# Altium schematic sheet 11-CPU_GPIO.SchDoc
size 431 x 279 mm; Organization: ORGANIZATION; Address1: ADDRESS 1; Address2: ADDRESS 2; Address3: ADDRESS 3; Address4: ADDRESS 4; DocumentNumber: 12; Revision: -; SheetNumber: 11; SheetTotal: 14; ENG_APP_DATE: --/--/--; DSN_APP_DATE: --/--/--; CHK_APP_DATE: --/--/--
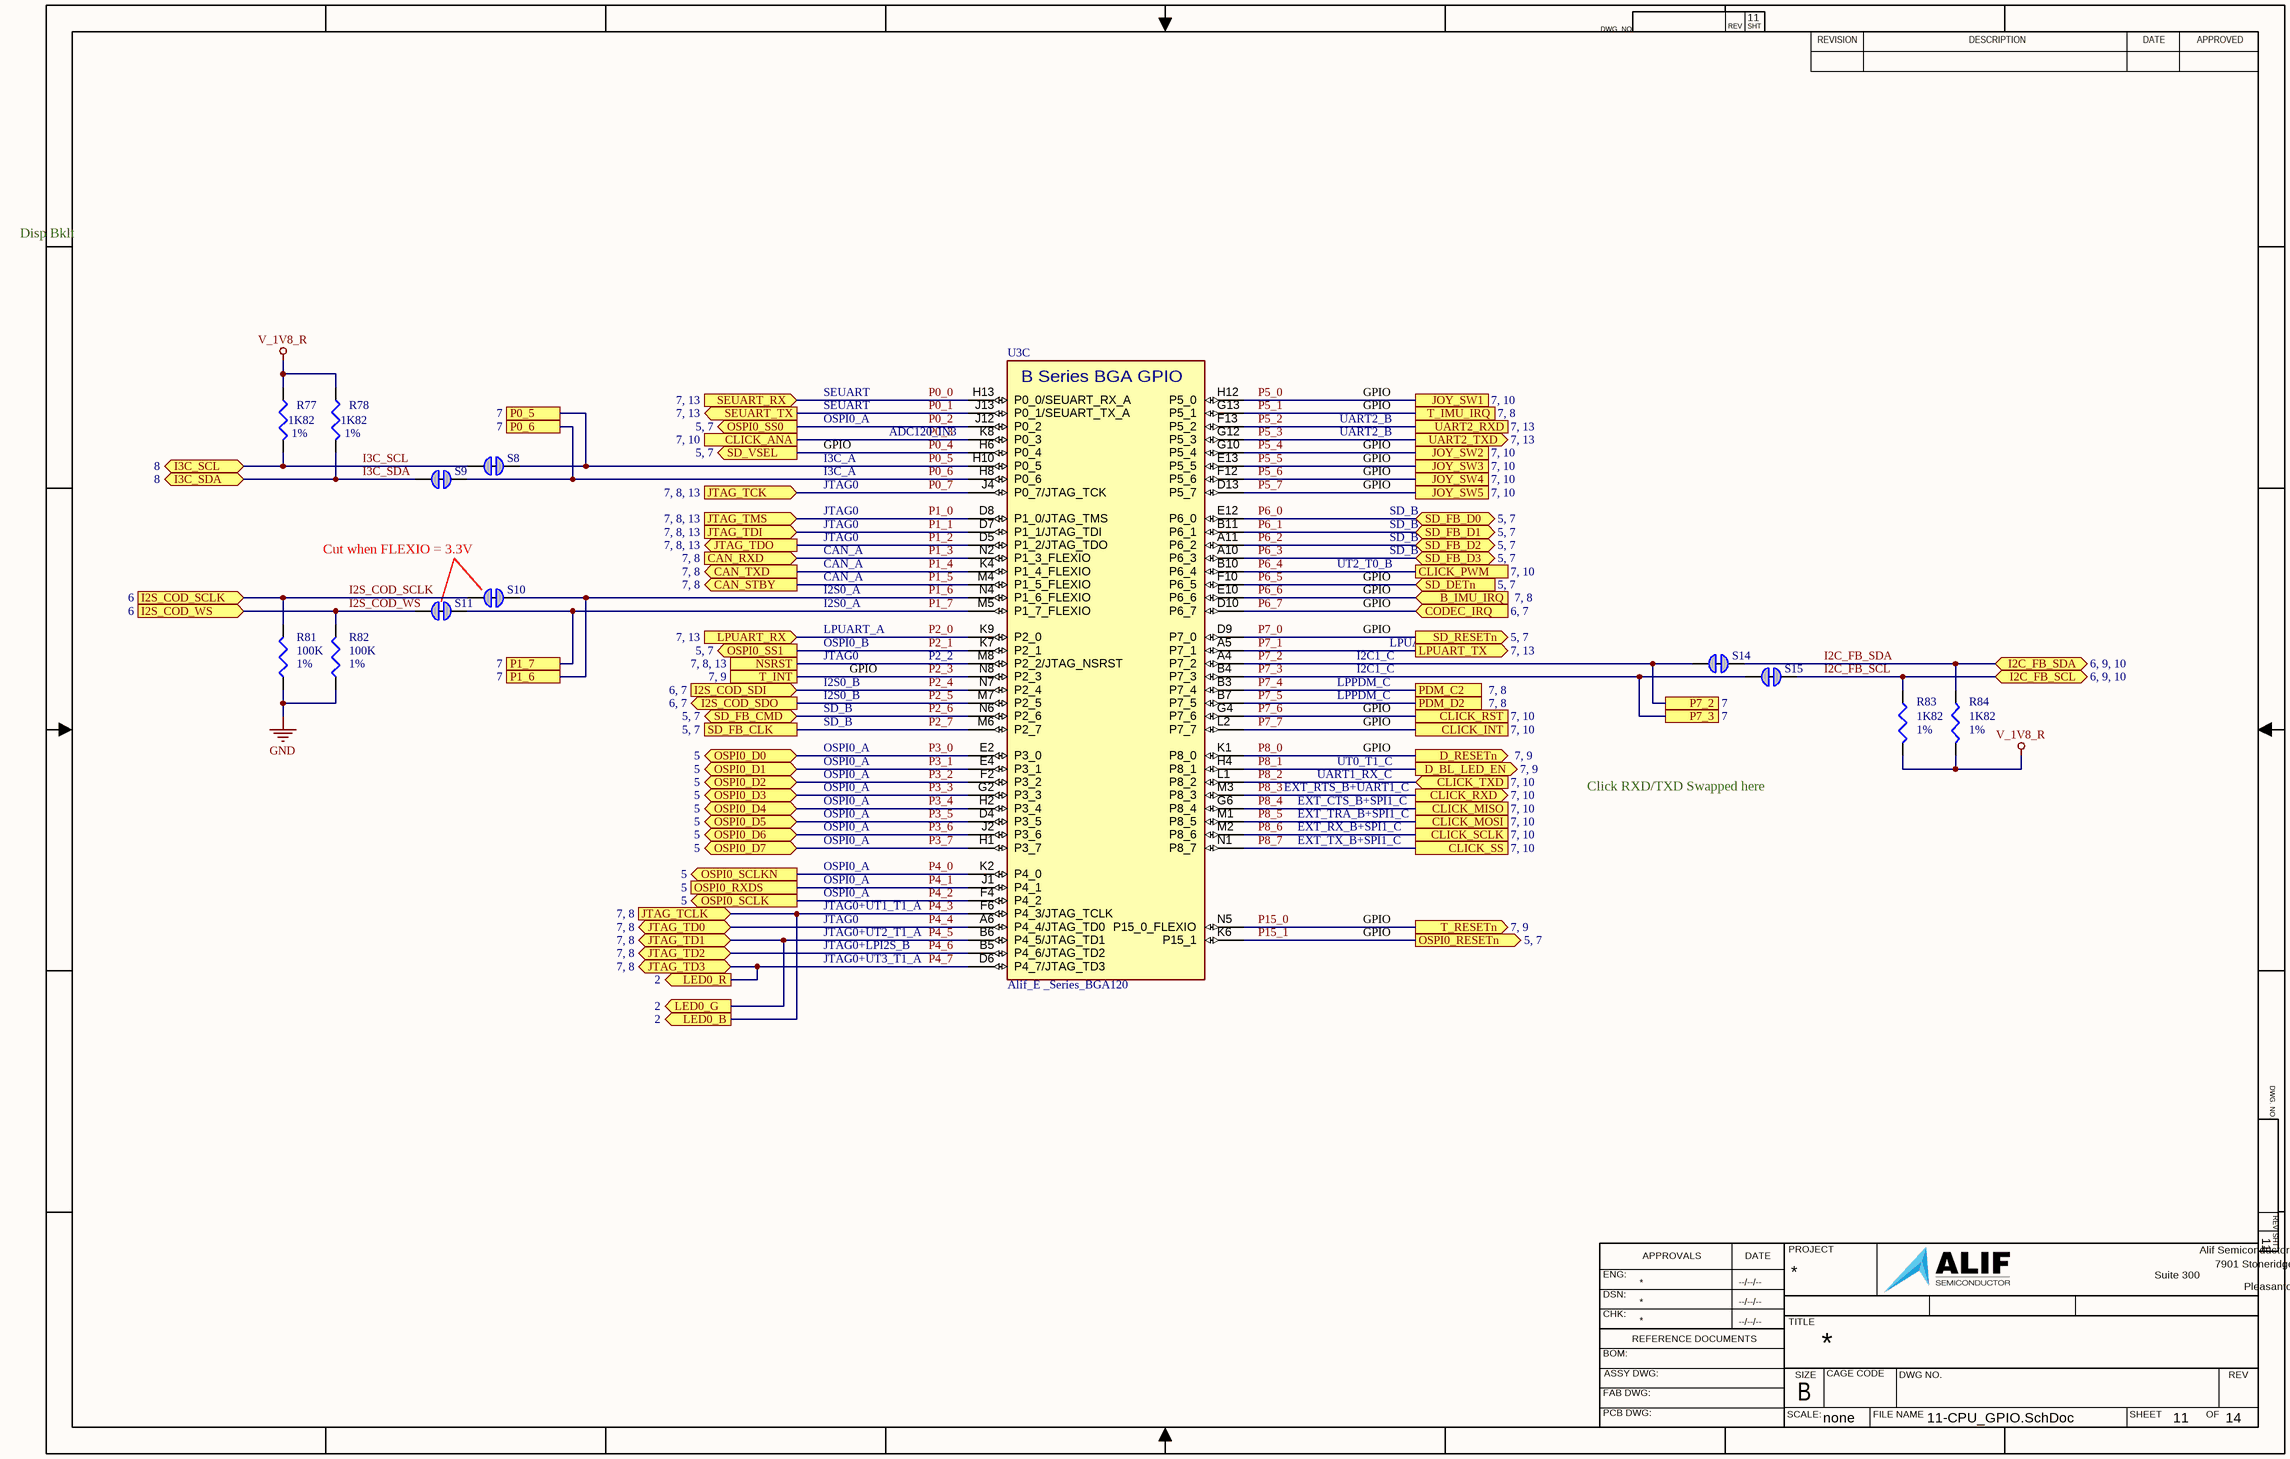
[diagram p0: 11-CPU_GPIO.SchDoc]

## Parts
R77  value 1K82  Tolerance: 1%  [RESC0402-01]  (hidden comment: Res3)
R78  value 1K82  Tolerance: 1%  [RESC0402-01]  (hidden comment: Res3)
R81  value 100K  Tolerance: 1%  [RESC0402-01]  (hidden comment: Res3)
R82  value 100K  Tolerance: 1%  [RESC0402-01]  (hidden comment: Res3)
R83  value 1K82  Tolerance: 1%  [RESC0402-01]  (hidden comment: Res3)
R84  value 1K82  Tolerance: 1%  [RESC0402-01]  (hidden comment: Res3)
S8  SolderJumperShorted_Small  [Solderbridge_Shorted]  (value not drawn)  (net tie, no BOM)
S9  SolderJumperShorted_Small  [Solderbridge_Shorted]  (value not drawn)  (net tie, no BOM)
S10  SolderJumperShorted_Small  [Solderbridge_Shorted]  (value not drawn)  (net tie, no BOM)
S11  SolderJumperShorted_Small  [Solderbridge_Shorted]  (value not drawn)  (net tie, no BOM)
S14  SolderJumperShorted_Small  [Solderbridge_Shorted]  (value not drawn)  (net tie, no BOM)
S15  SolderJumperShorted_Small  [Solderbridge_Shorted]  (value not drawn)  (net tie, no BOM)
U3  Alif_E _Series_BGA120  [BGA120_socket-NO_SOCK_3D]  (part C of 4)

## Ports
B_IMU_IRQ (in, see 7, 8), CAN_RXD (in, see 7, 8), CAN_STBY (out, see 7, 8), CAN_TXD (out, see 7, 8), CLICK_ANA (see 7, 10), CLICK_INT (see 7, 10), CLICK_MISO (see 7, 10), CLICK_MOSI (see 7, 10), CLICK_PWM (see 7, 10), CLICK_RST (see 7, 10), CLICK_RXD (out, see 7, 10), CLICK_SCLK (see 7, 10), CLICK_SS (see 7, 10), CLICK_TXD (in, see 7, 10), CODEC_IRQ (in, see 6, 7), D_BL_LED_EN (out, see 7, 9), D_RESETn (out, see 7, 9), I2C_FB_SCL (bidir, see 6, 9, 10), I2C_FB_SDA (bidir, see 6, 9, 10), I2S_COD_SCLK (in, see 6), I2S_COD_SDI (in, see 6, 7), I2S_COD_SDO (out, see 6, 7), I2S_COD_WS (in, see 6), I3C_SCL (bidir, see 8), I3C_SDA (bidir, see 8), JOY_SW1 (see 7, 10), JOY_SW2 (see 7, 10), JOY_SW3 (see 7, 10), JOY_SW4 (see 7, 10), JOY_SW5 (see 7, 10), JTAG_TCK (in, see 7, 8, 13), JTAG_TCLK (in, see 7, 8), JTAG_TD0 (bidir, see 7, 8), JTAG_TD1 (bidir, see 7, 8), JTAG_TD2 (bidir, see 7, 8), JTAG_TD3 (bidir, see 7, 8), JTAG_TDI (in, see 7, 8, 13), JTAG_TDO (out, see 7, 8, 13), JTAG_TMS (in, see 7, 8, 13), LED0_B (out, see 2), LED0_G (out, see 2), LED0_R (out, see 2), LPUART_RX (in, see 7, 13), LPUART_TX (out, see 7, 13), NSRST (see 7, 8, 13), OSPI0_D0 (bidir, see 5), OSPI0_D1 (bidir, see 5), OSPI0_D2 (bidir, see 5), OSPI0_D3 (bidir, see 5), OSPI0_D4 (bidir, see 5), OSPI0_D5 (bidir, see 5), OSPI0_D6 (bidir, see 5), OSPI0_D7 (bidir, see 5), OSPI0_RESETn (out, see 5, 7), OSPI0_RXDS (see 5), OSPI0_SCLK (out, see 5), OSPI0_SCLKN (out, see 5), OSPI0_SS0 (out, see 5, 7), OSPI0_SS1 (out, see 5, 7), P0_5 (see 7), P0_6 (see 7), P1_6 (see 7), P1_7 (see 7), P7_2 (see 7), P7_3 (see 7), PDM_C2 (see 7, 8), PDM_D2 (see 7, 8), SD_DETn (in, see 5, 7), SD_FB_CLK (see 5, 7), SD_FB_CMD (bidir, see 5, 7), SD_FB_D0 (bidir, see 5, 7), SD_FB_D1 (bidir, see 5, 7), SD_FB_D2 (bidir, see 5, 7), SD_FB_D3 (bidir, see 5, 7), SD_RESETn (out, see 5, 7), SD_VSEL (out, see 5, 7), SEUART_RX (in, see 7, 13), SEUART_TX (out, see 7, 13), T_IMU_IRQ (see 7, 8), T_INT (see 7, 9), T_RESETn (out, see 7, 9), UART2_RXD (see 7, 13), UART2_TXD (out, see 7, 13)

## Nets
GND: R81.1 R82.1
V_1V8_R: R77.2 R78.2 R83.2 R84.2
I2C_FB_SCL: R83.1 S15.1 ; port I2C_FB_SCL
I2C_FB_SDA: R84.1 S14.1 ; port I2C_FB_SDA
I2S_COD_SCLK: R81.2 S10.1 ; port I2S_COD_SCLK
I2S_COD_WS: R82.2 S11.1 ; port I2S_COD_WS
I3C_SCL: R77.1 S8.1 ; port I3C_SCL
I3C_SDA: R78.1 S9.1 ; port I3C_SDA
NSRST: U3.M8(P2_2/JTAG_NSRST) ; port NSRST
P0_0: U3.H13(P0_0/SEUART_RX_A) ; port SEUART_RX
P0_1: U3.J13(P0_1/SEUART_TX_A) ; port SEUART_TX
P0_2: U3.J12(P0_2) ; port OSPI0_SS0
P0_3: U3.K8(P0_3) ; port CLICK_ANA
P0_4: U3.H6(P0_4) ; port SD_VSEL
P0_5: S8.2 U3.H10(P0_5) ; port P0_5
P0_6: S9.2 U3.H8(P0_6) ; port P0_6
P0_7: U3.J4(P0_7/JTAG_TCK) ; port JTAG_TCK
P1_0: U3.D8(P1_0/JTAG_TMS) ; port JTAG_TMS
P1_1: U3.D7(P1_1/JTAG_TDI) ; port JTAG_TDI
P1_2: U3.D5(P1_2/JTAG_TDO) ; port JTAG_TDO
P1_3: U3.N2(P1_3_FLEXIO) ; port CAN_RXD
P1_4: U3.K4(P1_4_FLEXIO) ; port CAN_TXD
P1_5: U3.M4(P1_5_FLEXIO) ; port CAN_STBY
P1_6: S10.2 U3.N4(P1_6_FLEXIO) ; port P1_6
P1_7: S11.2 U3.M5(P1_7_FLEXIO) ; port P1_7
P2_0: U3.K9(P2_0) ; port LPUART_RX
P2_1: U3.K7(P2_1) ; port OSPI0_SS1
P2_3: U3.N8(P2_3) ; port T_INT
P2_4: U3.N7(P2_4) ; port I2S_COD_SDI
P2_5: U3.M7(P2_5) ; port I2S_COD_SDO
P2_6: U3.N6(P2_6) ; port SD_FB_CMD
P2_7: U3.M6(P2_7) ; port SD_FB_CLK
P3_0: U3.E2(P3_0) ; port OSPI0_D0
P3_1: U3.E4(P3_1) ; port OSPI0_D1
P3_2: U3.F2(P3_2) ; port OSPI0_D2
P3_3: U3.G2(P3_3) ; port OSPI0_D3
P3_4: U3.H2(P3_4) ; port OSPI0_D4
P3_5: U3.D4(P3_5) ; port OSPI0_D5
P3_6: U3.J2(P3_6) ; port OSPI0_D6
P3_7: U3.H1(P3_7) ; port OSPI0_D7
P4_0: U3.K2(P4_0) ; port OSPI0_SCLKN
P4_1: U3.J1(P4_1) ; port OSPI0_RXDS
P4_2: U3.F4(P4_2) ; port OSPI0_SCLK
P4_3: U3.F6(P4_3/JTAG_TCLK) ; port JTAG_TCLK, port LED0_B
P4_4: U3.A6(P4_4/JTAG_TD0) ; port JTAG_TD0
P4_5: U3.B6(P4_5/JTAG_TD1) ; port JTAG_TD1, port LED0_G
P4_6: U3.B5(P4_6/JTAG_TD2) ; port JTAG_TD2
P4_7: U3.D6(P4_7/JTAG_TD3) ; port JTAG_TD3, port LED0_R
P5_0: U3.H12(P5_0) ; port JOY_SW1
P5_1: U3.G13(P5_1) ; port T_IMU_IRQ
P5_2: U3.F13(P5_2) ; port UART2_RXD
P5_3: U3.G12(P5_3) ; port UART2_TXD
P5_4: U3.G10(P5_4) ; port JOY_SW2
P5_5: U3.E13(P5_5) ; port JOY_SW3
P5_6: U3.F12(P5_6) ; port JOY_SW4
P5_7: U3.D13(P5_7) ; port JOY_SW5
P6_0: U3.E12(P6_0) ; port SD_FB_D0
P6_1: U3.B11(P6_1) ; port SD_FB_D1
P6_2: U3.A11(P6_2) ; port SD_FB_D2
P6_3: U3.A10(P6_3) ; port SD_FB_D3
P6_4: U3.B10(P6_4) ; port CLICK_PWM
P6_5: U3.F10(P6_5) ; port SD_DETn
P6_6: U3.E10(P6_6) ; port B_IMU_IRQ
P6_7: U3.D10(P6_7) ; port CODEC_IRQ
P7_0: U3.D9(P7_0) ; port SD_RESETn
P7_1: U3.A5(P7_1) ; port LPUART_TX
P7_2: S14.2 U3.A4(P7_2) ; port P7_2
P7_3: S15.2 U3.B4(P7_3) ; port P7_3
P7_4: U3.B3(P7_4) ; port PDM_C2
P7_5: U3.B7(P7_5) ; port PDM_D2
P7_6: U3.G4(P7_6) ; port CLICK_RST
P7_7: U3.L2(P7_7) ; port CLICK_INT
P8_0: U3.K1(P8_0) ; port D_RESETn
P8_1: U3.H4(P8_1) ; port D_BL_LED_EN
P8_2: U3.L1(P8_2) ; port CLICK_TXD
P8_3: U3.M3(P8_3) ; port CLICK_RXD
P8_4: U3.G6(P8_4) ; port CLICK_MISO
P8_5: U3.M1(P8_5) ; port CLICK_MOSI
P8_6: U3.M2(P8_6) ; port CLICK_SCLK
P8_7: U3.N1(P8_7) ; port CLICK_SS
P15_0: U3.N5(P15_0_FLEXIO) ; port T_RESETn
P15_1: U3.K6(P15_1) ; port OSPI0_RESETn

## Notes on the sheet
- Disp Bklt
- OSPI0_A
- SEUART
- UART2_B
- GPIO
- JTAG0
- I3C_A
- ADC120_IN3
- Cut when FLEXIO = 3.3V
- CAN_A
- SD_B
- I2S0_A
- UT2_T0_B
- LPUART_A
- I2S0_B
- OSPI0_B
- P2_2
- LPPDM_C
- I2C1_C
- LPUART_C
- EXT_RTS_B+UART1_C
- EXT_CTS_B+SPI1_C
- EXT_TRA_B+SPI1_C
- UART1_RX_C
- UT0_T1_C
- Click RXD/TXD Swapped here
- EXT_RX_B+SPI1_C
- EXT_TX_B+SPI1_C
- JTAG0+UT1_T1_A
- JTAG0+UT2_T1_A
- JTAG0+LPI2S_B
- JTAG0+UT3_T1_A
- DWG. NO.
- REV
- SHT
- REVISION
- DESCRIPTION
- DATE
- APPROVED
- ENG:
- APPROVALS
- PROJECT
- Suite 300
- Alif Semiconductor
- 7901 Stoneridge Drive
- DSN:
- CHK:
- REFERENCE DOCUMENTS
- TITLE
- Pleasanton, CA 94588  USA
- BOM:
- FAB DWG:
- PCB DWG:
- ASSY DWG:
- SCALE:
- SIZE
- B
- CAGE CODE
- FILE NAME
- DWG NO.
- SHEET
- OF
- none
- (in symbol SPARK_B1_120BGA_A5, part C) B Series BGA GPIO

## Library data of the parts
R77 R78 R83 R84 = Res3: Res,1K82,1%,100ppm,0402; Manufacturer 1: Stackpol; Manufacturer Part Number 1: RMCF0402FT1K82; Wattage: 63mW; Published: 8-Jun-2000; LatestRevisionDate: 29-May-2009; LatestRevisionNote: IPC-7351 Footprint Added.; PackageReference: RESC0402-01; Publisher: Altium Limited; PackageDescription: Chip Resistor; Voltage: *; Type: Thick Film; Manufacturer 2: Yageo; Manufacturer Part Number 2: RC0402FR-071K82L; Manufacturer 3: Bourns; Manufacturer Part Number 3: CR0402-FX-1821GLF; PCB_Footprint: RESC0402-01
R81 R82 = Res3: Res,100K,1%,100ppm,0402; Manufacturer 1: Stackpol; Manufacturer Part Number 1: RMCF0402FT100K; Wattage: 63mW; Published: 8-Jun-2000; LatestRevisionDate: 29-May-2009; LatestRevisionNote: IPC-7351 Footprint Added.; PackageReference: RESC0402-01; Publisher: Altium Limited; PackageDescription: Chip Resistor; Voltage: *; Type: Thick Film; Manufacturer 2: Yageo; Manufacturer Part Number 2: RC0402FR-07100KL; Manufacturer 3: Bourns; Manufacturer Part Number 3: CR0402-FX-1003GLF; PCB_Footprint: RESC0402-01
S8-S11 S14 S15 = SolderJumperShorted_Small: DNI,Solderable Jumper,Shorted; Wattage: 63mW; PCB_Footprint: SSHORTED; Published: 8-Jun-2000; LatestRevisionDate: 29-May-2009; LatestRevisionNote: IPC-7351 Footprint Added.; PackageReference: J1-0603; Publisher: Altium Limited; PackageDescription: Chip Resistor; Voltage: *; Type: Thick Film; Manufacturer 1: *; Manufacturer Part Number 1: *; Manufacturer 2: *; Manufacturer Part Number 2: *; Manufacturer 3: *; Manufacturer Part Number 3: *; Tolerance: *; Value: *
U3 = SPARK_B1_120BGA_A5: IC,Alif Spark B1 MCU, Rev A5 silicon,BGA120; Manufacturer 1: Alif Semi; Manufacturer Part Number 1: AB1C1F4M51820PH0